# EAGLE schematic emonthKsm_1 (EAGLE 7.5.0)
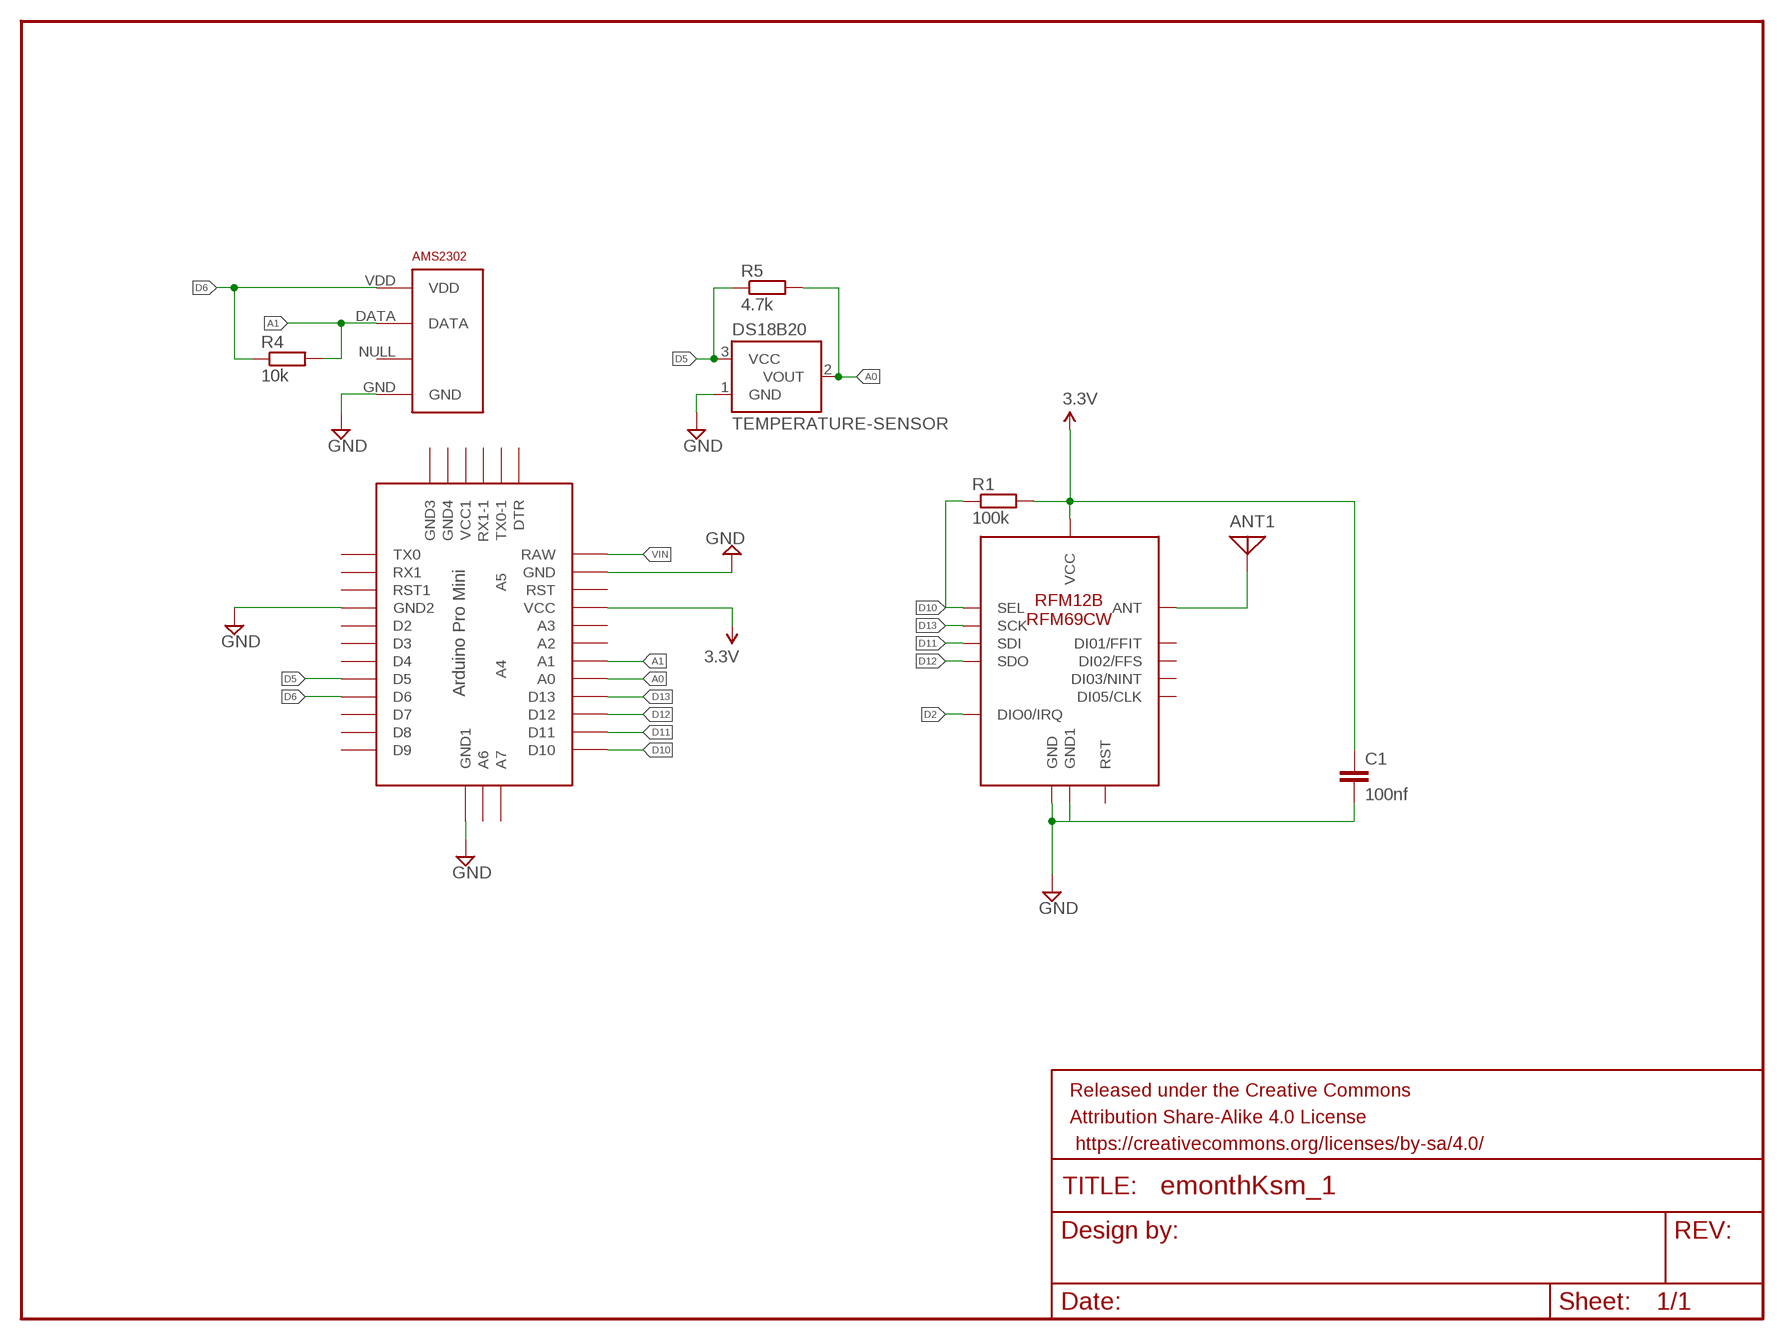
[diagram p0: schematic, sheet 1]

## Parts
AMS2302  RHT03_DHT-22_AM2302  [RHT03_DHT-22]
ANT1  ANTENNA  [PAD-01]
ARDUINO  ABK-PRO-MINI  [ABK-PRO-MINI]
C1  100nf  C-EU050-050X075  [C050-050X075]
DS18B20  TEMPERATURE-SENSOR  [TO-92]
FRAME1  FRAME-LETTERNO_PACKAGE  [DUMMY]
R1  100k  R-EU_0204/7  [0204/7]
R4  10k  R-EU_0204/7  [0204/7]
R5  4.7k  R-EU_0204/7  [0204/7]
RFM69  RFM12B/69CW  [RFM12B/69CW]

## Nets
3.3V: ARDUINO.VCC C1.1 R1.2 RFM69.VDD(VCC)
A0: ARDUINO.A0 DS18B20.2(VOUT) R5.2
A1: AMS2302.DATA ARDUINO.A1 R4.2
D2: RFM69.IRQ(DIO0/IRQ)
D5: ARDUINO.D5 DS18B20.3(VCC) R5.1
D6: AMS2302.VDD ARDUINO.D6 R4.1
D10: ARDUINO.D10 R1.1 RFM69.SEL
D11: ARDUINO.D11 RFM69.SDI
D12: ARDUINO.D12 RFM69.SDO
D13: ARDUINO.D13 RFM69.SCK
GND: AMS2302.GND ARDUINO.GND ARDUINO.GND1(GND2) ARDUINO.GND4(GND1) C1.2 DS18B20.1(GND) RFM69.GND RFM69.GND1
N$1: ANT1.1 RFM69.ANT
VIN: ARDUINO.RAW
Unconnected: AMS2302.NULL ARDUINO.A2 ARDUINO.A3 ARDUINO.A4 ARDUINO.A5 ARDUINO.A6 ARDUINO.A7 ARDUINO.D2 ARDUINO.D3 ARDUINO.D4 ARDUINO.D7 ARDUINO.D8 ARDUINO.D9 ARDUINO.DTR ARDUINO.GND2(GND3) ARDUINO.GND3(GND4) ARDUINO.RST ARDUINO.RST1 ARDUINO.RX1 ARDUINO.RX1-1 ARDUINO.TX0 ARDUINO.TX0-1 ARDUINO.VCC1 RFM69.CLK(DI05/CLK) RFM69.FFIT(DI01/FFIT) RFM69.FFS(DI02/FFS) RFM69.NINT(DI03/NINT) RFM69.RST

## Library data of the parts
AMS2302 = RHT03_DHT-22_AM2302:RHT03_DHT-22_AM2302: RHT03 / DHT-22 / AM2302 Packages and symbol for the RHT03 / DHT-22 relative humidity and temperature sensor. Note: The AM2302 is a wired version of the DHT-22 which typically requires less clearance and is thus provided as a separate package.; PROD_ID: SEN-10167
ANT1 = discrete:ANTENNA: Antenna
ARDUINO = Arduino-clone:ABK-PRO-MINI: ABK Pro-Mini Arduino Clone
C1 = rcl:C-EU: CAPACITOR, European symbol
DS18B20 = Eagle-JeeLabs:TEMPERATURE-SENSOR: DS18B20 1-wire temperature sensor
FRAME1 = SparkFun-Aesthetics:FRAME-LETTER: Schematic Frame Standard 8.5x11 US Letter frame; DESIGNER: Nobody; VERSION: v01
R1 R4 R5 = rcl:R-EU_: RESISTOR, European symbol
RFM69 = Eagle-JeeLabs:RFM12B/69CW

## Net classes
0 default: width 0.3 mm, drill 0.5 mm, clearance 0.3 mm